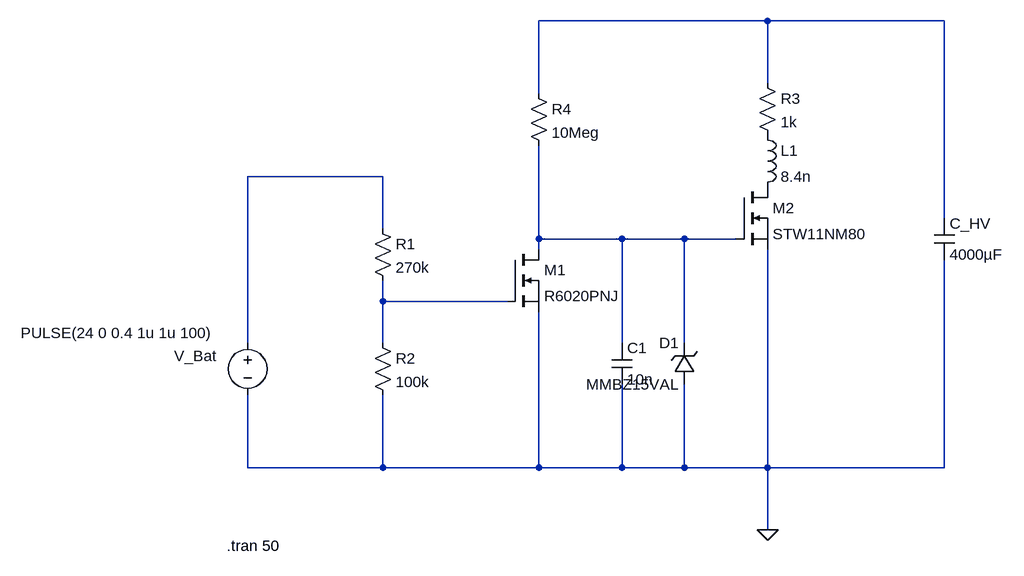
[diagram p0: schematic auto_discharge_dualN.asc]
auto_discharge_dualN.asc, the LTspice schematic file:
Version 4
SHEET 1 1944 680
WIRE 736 -144 384 -144
WIRE 1008 -144 736 -144
WIRE 736 -48 736 -144
WIRE 384 -32 384 -144
WIRE 144 96 -64 96
WIRE 1008 160 1008 -144
WIRE 144 176 144 96
WIRE 384 192 384 48
WIRE 512 192 384 192
WIRE 608 192 512 192
WIRE 688 192 608 192
WIRE 384 208 384 192
WIRE 144 288 144 256
WIRE 336 288 144 288
WIRE -64 352 -64 96
WIRE 144 352 144 288
WIRE 512 352 512 192
WIRE 608 352 608 192
WIRE -64 544 -64 432
WIRE 144 544 144 432
WIRE 144 544 -64 544
WIRE 384 544 384 304
WIRE 384 544 144 544
WIRE 512 544 512 416
WIRE 512 544 384 544
WIRE 608 544 608 416
WIRE 608 544 512 544
WIRE 736 544 736 208
WIRE 736 544 608 544
WIRE 1008 544 1008 224
WIRE 1008 544 736 544
WIRE 736 640 736 544
FLAG 736 640 0
SYMBOL voltage -64 336 R0
WINDOW 0 -113 36 Left 2
WINDOW 3 -349 1 Left 2
WINDOW 123 0 0 Left 0
WINDOW 39 0 0 Left 0
SYMATTR InstName V_Bat
SYMATTR Value PULSE(24 0 0.4 1u 1u 100)
SYMBOL cap 992 160 R0
SYMATTR InstName C_HV
SYMATTR Value 4000µF
SYMATTR SpiceLine IC=250
SYMBOL nmos 336 208 R0
SYMATTR InstName M1
SYMATTR Value R6020PNJ
SYMBOL nmos 688 112 R0
SYMATTR InstName M2
SYMATTR Value STW11NM80
SYMBOL res 128 160 R0
SYMATTR InstName R1
SYMATTR Value 270k
SYMBOL res 128 336 R0
SYMATTR InstName R2
SYMATTR Value 100k
SYMBOL res 720 -64 R0
SYMATTR InstName R3
SYMATTR Value 1k
SYMBOL res 368 -48 R0
SYMATTR InstName R4
SYMATTR Value 10Meg
SYMBOL cap 496 352 R0
SYMATTR InstName C1
SYMATTR Value 10n
SYMBOL ind 720 16 R0
SYMATTR InstName L1
SYMATTR Value 8.4n
SYMBOL zener 624 416 R180
WINDOW 0 24 64 Left 2
WINDOW 3 24 0 Left 2
SYMATTR InstName D1
SYMATTR Value MMBZ15VAL
SYMATTR Description Diode
SYMATTR Type diode
TEXT -96 664 Left 2 !.tran 50

The netlist it stands for:
* auto_discharge_dualN.asc
V_Bat N002 0 PULSE(24 0 0.4 1u 1u 100)
C_HV N001 0 4000µF IC=250
M1 N003 N004 0 0 R6020PNJ
M2 P001 N003 0 0 STW11NM80
R1 N002 N004 270k
R2 N004 0 100k
R3 N001 P002 1k
R4 N001 N003 10Meg
C1 N003 0 10n
L1 P002 P001 8.4n
D1 0 N003 MMBZ15VAL
.model D D
.lib standard.dio
.model NMOS NMOS
.model PMOS PMOS
.lib standard.mos
.tran 50
.backanno
.end